# EAGLE schematic Schematic_V4.0 (EAGLE 9.7.0)
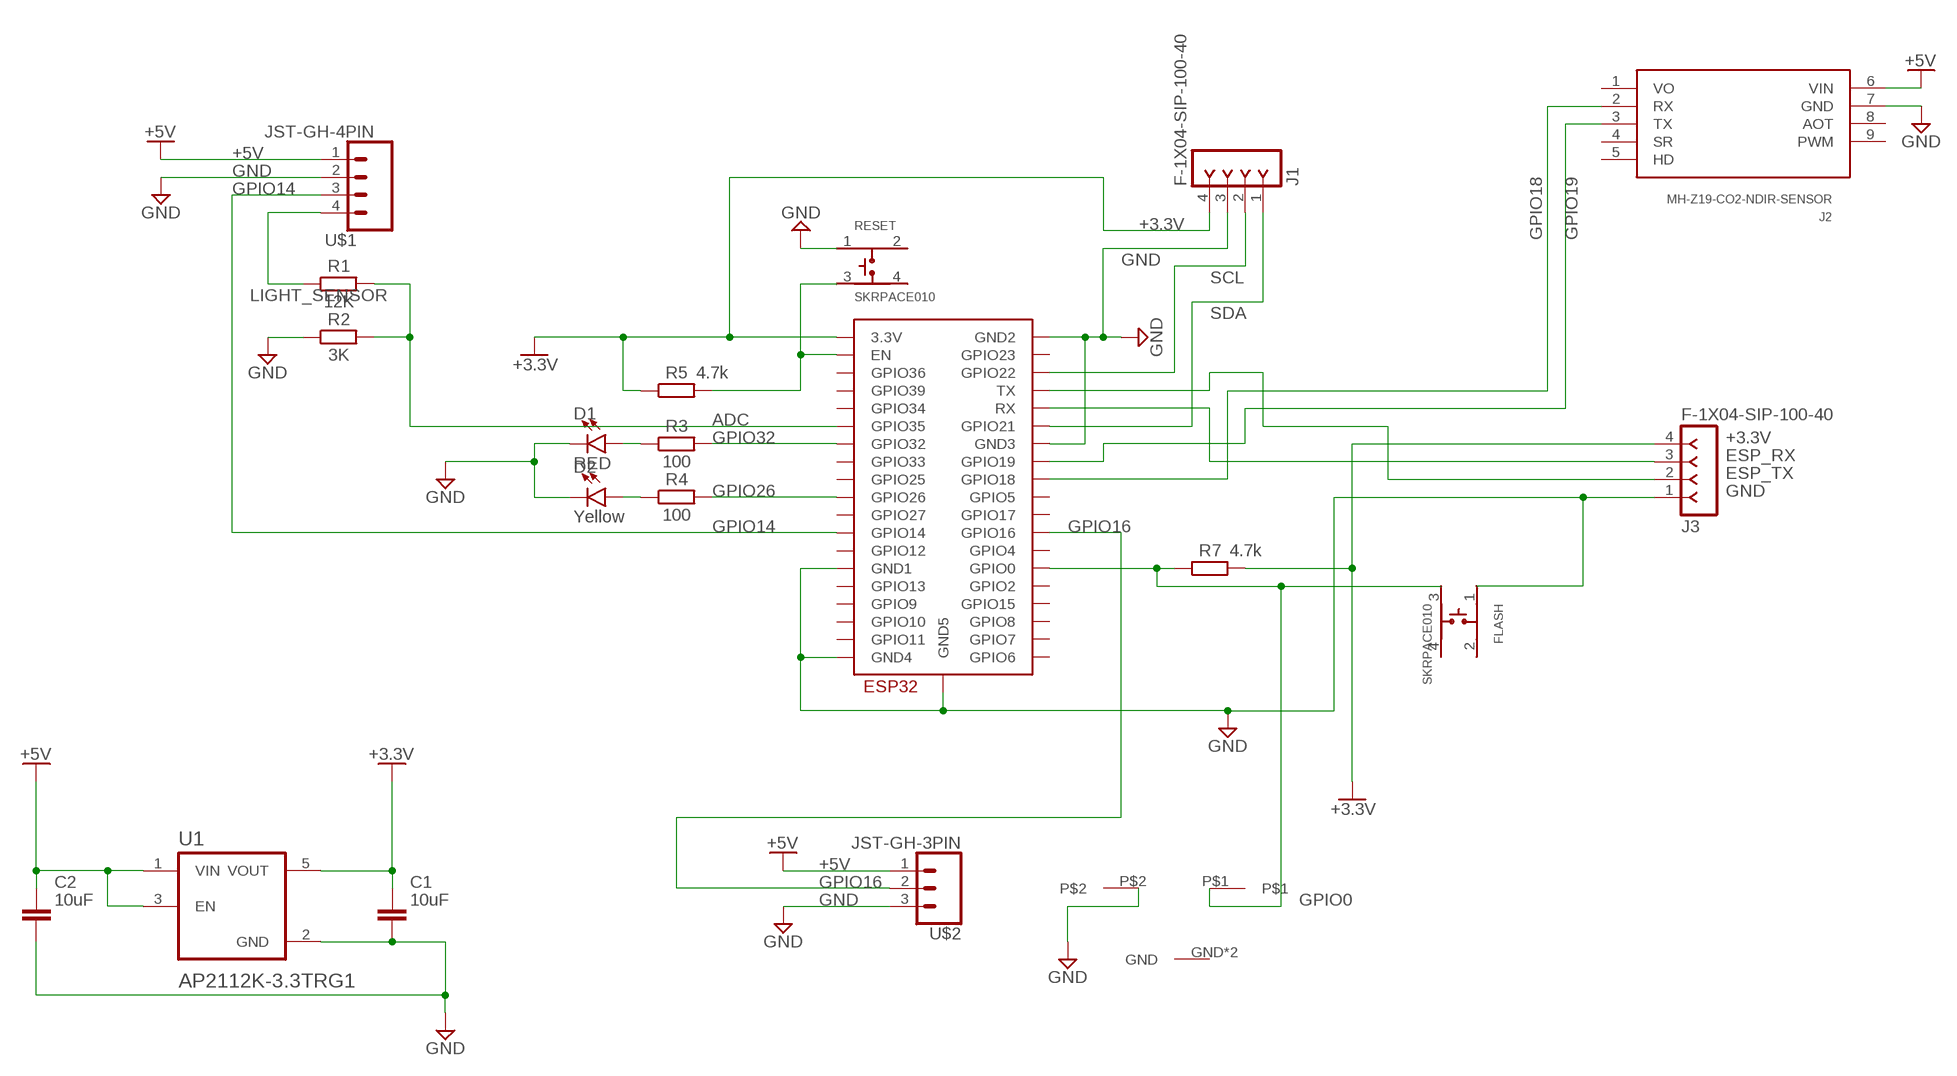
[diagram p0: schematic, sheet 1]

## Parts
C1  10uF  C_CHIP-0603(1608-METRIC)  [CAPC1608X85]
C2  10uF  C_CHIP-0603(1608-METRIC)  [CAPC1608X85]
D1  RED  LED-RED0603  [LED-0603]
D2  Yellow  LED-YELLOW0603  [LED-0603]
FLASH  SKRPACE010  [SW_SKRPACE010]
J1  F-1X04-SIP-100-40  [SIP-100-04-40]
J2  MH-Z19-CO2-NDIR-SENSOR  [MH-Z19]
J3  F-1X04-SIP-100-40  [SIP-100-04-40]
R1  12K  R_CHIP-0603(1608-METRIC)  [RESC1608X60]
R2  3K  R_CHIP-0603(1608-METRIC)  [RESC1608X60]
R3  100  R_CHIP-0603(1608-METRIC)  [RESC1608X60]
R4  100  R_CHIP-0603(1608-METRIC)  [RESC1608X60]
R5  4.7k  R_CHIP-0603(1608-METRIC)  [RESC1608X60]
R7  4.7k  R_CHIP-0603(1608-METRIC)  [RESC1608X60]
RESET  SKRPACE010  [SW_SKRPACE010]
U1  AP2112K-3.3TRG1  [SOT95P285X140-5N]
U$1  JST-GH-4PIN  [JST-GH-4PIN]
U$2  JST-GH-3PIN  [JST-GH-3PIN]
U$3  ESP32-WROOM  [ESP32-WROOM]
U$4  MOMENTARY-SWITCH  [SWITCH-MOMENTARY]

## Nets
+3.3V [5V]: C1.1 J1.4 J3.4 R5.1 R7.2 U1.5(VOUT) U$3.3V3(3.3V)
+5V [5V]: C2.1 J2.6(VIN) U1.1(VIN) U1.3(EN) U$1.1 U$2.1
ADC: R1.2 R2.2 U$3.IO35(GPIO35)
ESP_RX: J3.3 U$3.RX
ESP_TX: J3.2 U$3.TX
GND [GND]: C1.2 C2.2 D1.C D2.C FLASH.1 J1.3 J2.7(GND) J3.1 R2.1 RESET.1 U1.2(GND) U$1.2 U$2.3 U$3.GND1 U$3.GND2 U$3.GND3 U$3.GND4 U$3.GND5 U$4.P$2
GPIO0: FLASH.3 R7.1 U$3.IO0(GPIO0) U$4.P$1
GPIO14: U$1.3 U$3.IO14(GPIO14)
GPIO16: U$2.2 U$3.IO16(GPIO16)
GPIO18: J2.2(RX) U$3.IO18(GPIO18)
GPIO19: J2.3(TX) U$3.IO19(GPIO19)
GPIO26: R4.2 U$3.IO26(GPIO26)
GPIO32: R3.2 U$3.IO32(GPIO32)
LIGHT_SENSOR: R1.1 U$1.4
N$4: D1.A R3.1
N$5: D2.A R4.1
RESET: R5.2 RESET.3 U$3.EN
SCL: J1.2 U$3.IO22(GPIO22)
SDA: J1.1 U$3.IO21(GPIO21)
Unconnected: FLASH.2 FLASH.4 J2.4(SR) J2.5(HD) J2.8(AOT) J2.9(PWM) RESET.2 RESET.4 U$3.CLK(GPIO6) U$3.CMD(GPIO11) U$3.IO2(GPIO2) U$3.IO4(GPIO4) U$3.IO5(GPIO5) U$3.IO12(GPIO12) U$3.IO13(GPIO13) U$3.IO15(GPIO15) U$3.IO17(GPIO17) U$3.IO23(GPIO23) U$3.IO25(GPIO25) U$3.IO27(GPIO27) U$3.IO33(GPIO33) U$3.IO34(GPIO34) U$3.SD0(GPIO7) U$3.SD1(GPIO8) U$3.SD2(GPIO9) U$3.SD3(GPIO10) U$3.SENSOR_VN(GPIO39) U$3.SENSOR_VP(GPIO36) U$4.GND U$4.GND_2(GND)

## Power pins joined to a net without a drawn wire
VO: J2.1(VO)

## Library data of the parts
C1 C2 = Capacitor:C: Capacitor - Generic; CATEGORY: Capacitor
D1 = SparkFun-LED:LED-RED: Red SMD LED Used in manufacturing of most products at SparkFun Packages: 0603 - SMD 0603 package [Product Link] <http://docs.avagotech.com/docs/AV02-0551EN> 0603 SMART - SMD 0603 SMART package ( more efficient and expensive)[Product Link] <http://www.osram-os.com/Graphics/XPic2/00077099_0.pdf> 1206 - SMD1206 package [Product Link] <https://www.sparkfun.com/datasheets/DevTools/LilyPad/Q150OVS4.pdff> SparkFun Products: Pro Mini 328 -5V <https://www.sparkfun.com/products/821> RedBoard <https://www.sparkfun.com/products/12757> IOIO-OTG <https://www.sparkfun.com/products/13613>; PROD_ID: DIO-00819
D2 = SparkFun-LED:LED-YELLOW: Yellow SMD LED Used in manufacturing several products at SparkFun. Packages: 0603 - SMD 0603 package[Product Link] <http://www.kingbrightusa.com/product.asp?catalog_name=LED&product_id=APT1608SYCK> 0603 -SMART - SMART SMD 0603 package (more efficient/more expensive) [Product Link] <http://www.osram-os.com/osram_os/en/products/product-catalog/led-light-emitting-diodes/smartled-0603/ly-l29k/index.jsp> LilyPad - SMD1206 package[Product Datasheet] <https://www.sparkfun.com/datasheets/DevTools/LilyPad/Q150YUS4.pdf> SparkFun Products: Blynk Board <https://www.sparkfun.com/products/13794> IOIO-OTG <https://www.sparkfun.com/products/13613> XBee Explorer Serial <https://www.sparkfun.com/products/13225>; PROD_ID: DIO-09003
FLASH RESET = SKRPACE010:SKRPACE010: Switch Tactile N.O. SPST Button J-Bend 0.05A 16VDC 2.55N SMD Automotive T/R; MANUFACTURER: ALPS; STANDARD: Maniufacturer Recommendations
J1 J3 = con-headers-jp:F-1X04-: FEMALE HEADER
J2 = mh-z19:MH-Z19: MH-Z19 - CO2 NDIR SENSOR
R1-R5 R7 = Resistor:R: Resistor Fixed - Generic; CATEGORY: Resistor; SUB-CATEGORY: Fixed
U1 = AP2112K-3.3TRG1:AP2112K-3.3TRG1: AP2112 Series 0.6 A 3.3 V Fixed Output SMT LDO Linear Regulator - SOT23-5; MANUFACTURER: Diodes Inc.; PARTREV: 2-2
U$1 = My JST-GH Connectors Library:JST-GH-4PIN
U$2 = My JST-GH Connectors Library:JST-GH-3PIN
U$3 = ESP32:ESP32-WROOM
U$4 = Tactile Switches:MOMENTARY-SWITCH

## Net classes
0 default: width 0.381 mm
1 5V: width 0.762 mm
2 GND: width 0.762 mm